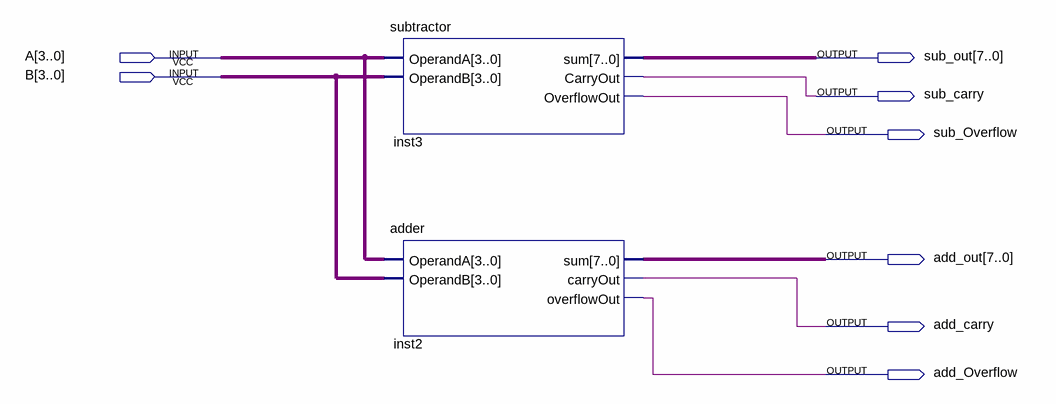
[diagram p0: schematic sheet]
// Quartus schematic sub_and_add.bdf as structural Verilog: 2 symbols, 8 pins
module sub_and_add (
  input  [3:0] A,
  input  [3:0] B,
  output [7:0] sub_out,
  output sub_carry,
  output sub_Overflow,
  output [7:0] add_out,
  output add_carry,
  output add_Overflow
);

  subtractor inst3 (.OperandA(A), .OperandB(B), .sum(sub_out), .CarryOut(sub_carry), .OverflowOut(sub_Overflow));
  adder inst2 (.OperandA(A), .OperandB(B), .sum(add_out), .carryOut(add_carry), .overflowOut(add_Overflow));
endmodule
